# EAGLE design tvbgone-2layer (EAGLE 6.5.0)
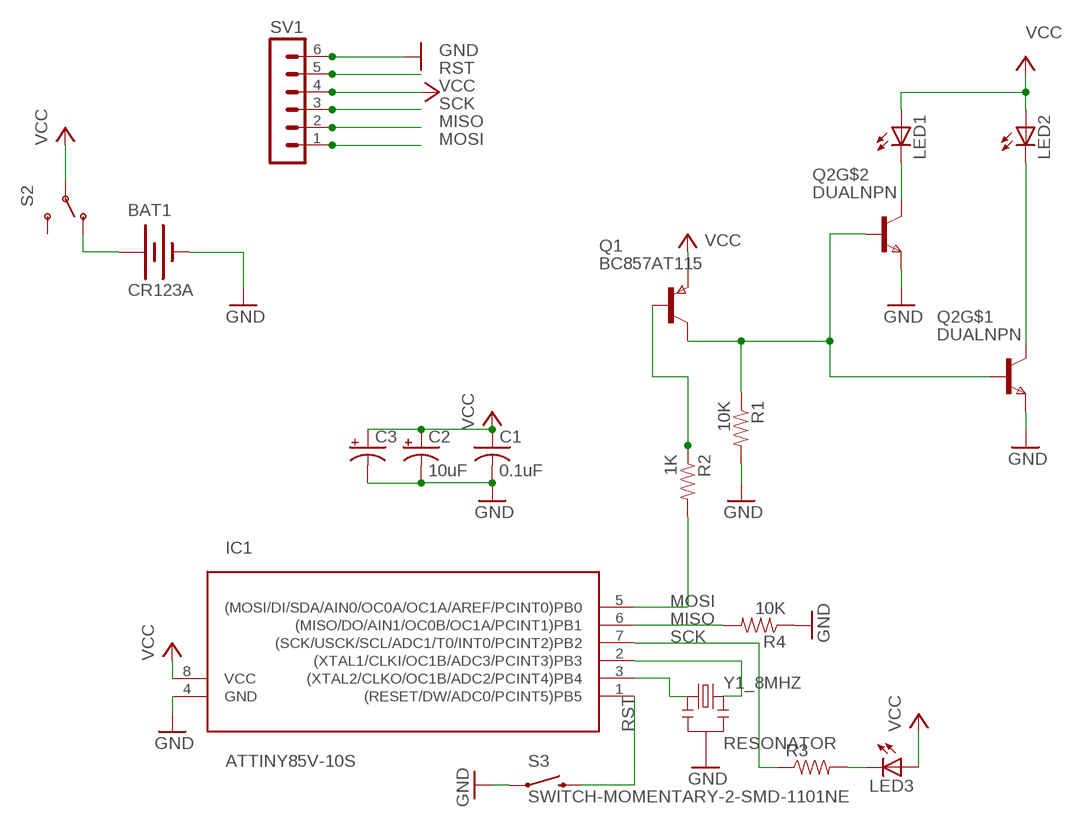
[diagram p0: schematic, sheet 1]

## Parts
BAT1  CR123A  TVBGONE-ADJ_BATTERYCR123A  [TVBGONE-ADJ_BATTERY_CR123A]
C1  0.1uF  C-USC0603K  [C0603K]
C2  10uF  CAP_POL1206  [EIA3216]
C3  SPARKFUN_CAP_POL3528  [SPARKFUN_EIA3528]
IC1  ATTINY85V-10S  [SOIC8]
LED1  TVBGONE3_LEDSIDEIR  [TVBGONE3_SIDE_IR_NSL]
LED2  TVBGONE3_LEDSIDEIR  [TVBGONE3_SIDE_IR_NSL]
LED3  LEDCHIPLED_0603  [CHIPLED_0603]
Q1  BC857AT115  PNPSOT323SOT416  [SOT416]
Q2  DUALNPN  [SSOT6]
R1  10K  RESISTOR  [0805]
R2  1K  RESISTOR  [0805]
R3  1K  RESISTOR  [0805]
R4  10K  RESISTOR  [0805]
S2  SWITCH-SPDT-SMD-A  [SWITCH-SPST-SMD-A]
S3  SWITCH-MOMENTARY-2-SMD-1101NE  [TACTILE-SWITCH-1101NE]
SV1  CON-LSTB_MA06-1  [CON-LSTB_MA06-1]
Y1_8MHZ  RESONATOR  SPARKFUN_RESONATORSMD  [SPARKFUN_RESONATOR-SMD]

## Nets
GND: BAT1.- C1.2 C2.C(-) C3.C(-) IC1.4(GND) Q2.2(E) Q2.5(E) R1.2 R4.1 S3.P$1 SV1.6 Y1_8MHZ.2
MISO: IC1.6((MISO/DO/AIN1/OC0B/OC1A/PCINT1)PB1) R4.2 SV1.2
MOSI: IC1.5((MOSI/DI/SDA/AIN0/OC0A/OC1A/AREF/PCINT0)PB0) R2.2 SV1.1
N$1: IC1.3((XTAL2/CLKO/OC1B/ADC2/PCINT4)PB4) Y1_8MHZ.1
N$2: IC1.2((XTAL1/CLKI/OC1B/ADC3/PCINT3)PB3) Y1_8MHZ.3
N$3: LED3.C R3.2
N$4: LED1.C Q2.4(C)
N$5: LED2.C Q2.6(C)
N$6: Q1.2(B) R2.1
N$8: BAT1.+ S2.1(O)
N$9: Q1.1(C) Q2.1(B) Q2.3(B) R1.1
RST: IC1.1((RESET/DW/ADC0/PCINT5)PB5) S3.P$2 SV1.5
SCK: IC1.7((SCK/USCK/SCL/ADC1/T0/INT0/PCINT2)PB2) R3.1 SV1.3
VCC: C1.1 C2.A(+) C3.A(+) IC1.8(VCC) LED1.A LED2.A LED3.A Q1.3(E) S2.2(P) SV1.4
Unconnected: S2.3(S)

## Library data of the parts
BAT1 = tvbgone-2layer:TVBGONE-ADJ_BATTERY: Battery Holders Various common sizes : AA, AAA, 20mm coin cell and 12mm coin cell.
C1 = rcl-ez:C-US: CAPACITOR, American symbol
C2 = SparkFun:CAP_POL: Capacitor Polarized These are standard SMD and PTH capacitors. Normally 10uF, 47uF, and 100uF in electrolytic and tantalum varieties. Always verify the external diameter of the through hole cap, it varies with capacity, voltage, and manufacturer. The EIA devices should be standard.
C3 = tvbgone-2layer:SPARKFUN_CAP_POL: Capacitor Polarized These are standard SMD and PTH capacitors. Normally 10uF, 47uF, and 100uF in electrolytic and tantalum varieties. Always verify the external diameter of the through hole cap, it varies with capacity, voltage, and manufacturer. The EIA devices should be standard.
IC1 = avr:ATTINY85: MICROCONTROLLER 8 Kbytes FLASH 512 bytes EEPROM 512 bytes RAM 4-channel 10 bit ADC USI
LED1 LED2 = tvbgone-2layer:TVBGONE3_LED: LED OSRAM: - CHIPLED LG R971, LG N971, LY N971, LG Q971, LY Q971, LO R971, LY R971 LH N974, LH R974 LS Q976, LO Q976, LY Q976 LO Q996 - Hyper CHIPLED LW Q18S LB Q993, LB Q99A, LB R99A - SideLED LS A670, LO A670, LY A670, LG A670, LP A670 LB A673, LV A673, LT A673, LW A673 LH A674 LY A675 LS A676, LA A676, LO A676, LY A676, LW A676 LS A679, LY A679, LG A679 - Hyper Micro SIDELED® LS Y876, LA Y876, LO Y876, LY Y876 LT Y87S - SmartLED LW L88C, LW L88S LB L89C, LB L89S, LG L890 LS L89K, LO L89K, LY L89K LS L896, LA L896, LO L896, LY L896 - TOPLED LS T670, LO T670, LY T670, LG T670, LP T670 LSG T670, LSP T670, LSY T670, LOP T670, LYG T670 LG T671, LOG T671, LSG T671 LB T673, LV T673, LT T673, LW T673 LH T674 LS T676, LA T676, LO T676, LY T676, LB T676, LH T676, LSB T676, LW T676 LB T67C, LV T67C, LT T67C, LS T67K, LO T67K, LY T67K, LW E67C LS E67B, LA E67B, LO E67B, LY E67B, LB E67C, LV E67C, LT E67C LW T67C LS T679, LY T679, LG T679 LS T770, LO T770, LY T770, LG T770, LP T770 LB T773, LV T773, LT T773, LW T773 LH T774 LS E675, LA E675, LY E675, LS T675 LS T776, LA T776, LO T776, LY T776, LB T776 LHGB T686 LT T68C, LB T68C - Hyper Mini TOPLED® LB M676 - Mini TOPLED Santana® LG M470 LS M47K, LO M47K, LY M47K Source: http://www.osram.convergy.de LUXEON: - LUMILED® LXK2-PW12-R00, LXK2-PW12-S00, LXK2-PW14-U00, LXK2-PW14-V00 LXK2-PM12-R00, LXK2-PM12-S00, LXK2-PM14-U00 LXK2-PE12-Q00, LXK2-PE12-R00, LXK2-PE12-S00, LXK2-PE14-T00, LXK2-PE14-U00 LXK2-PB12-K00, LXK2-PB12-L00, LXK2-PB12-M00, LXK2-PB14-N00, LXK2-PB14-P00, LXK2-PB14-Q00 LXK2-PR12-L00, LXK2-PR12-M00, LXK2-PR14-Q00, LXK2-PR14-R00 LXK2-PD12-Q00, LXK2-PD12-R00, LXK2-PD12-S00 LXK2-PH12-R00, LXK2-PH12-S00 LXK2-PL12-P00, LXK2-PL12-Q00, LXK2-PL12-R00 Source: www.luxeon.com KINGBRIGHT: KA-3528ASYC Source: www.kingbright.com
LED3 = minimidi:LED: LED OSRAM: - CHIPLED LG R971, LG N971, LY N971, LG Q971, LY Q971, LO R971, LY R971 LH N974, LH R974 LS Q976, LO Q976, LY Q976 LO Q996 - Hyper CHIPLED LW Q18S LB Q993, LB Q99A, LB R99A - SideLED LS A670, LO A670, LY A670, LG A670, LP A670 LB A673, LV A673, LT A673, LW A673 LH A674 LY A675 LS A676, LA A676, LO A676, LY A676, LW A676 LS A679, LY A679, LG A679 - Hyper Micro SIDELED® LS Y876, LA Y876, LO Y876, LY Y876 LT Y87S - SmartLED LW L88C, LW L88S LB L89C, LB L89S, LG L890 LS L89K, LO L89K, LY L89K LS L896, LA L896, LO L896, LY L896 - TOPLED LS T670, LO T670, LY T670, LG T670, LP T670 LSG T670, LSP T670, LSY T670, LOP T670, LYG T670 LG T671, LOG T671, LSG T671 LB T673, LV T673, LT T673, LW T673 LH T674 LS T676, LA T676, LO T676, LY T676, LB T676, LH T676, LSB T676, LW T676 LB T67C, LV T67C, LT T67C, LS T67K, LO T67K, LY T67K, LW E67C LS E67B, LA E67B, LO E67B, LY E67B, LB E67C, LV E67C, LT E67C LW T67C LS T679, LY T679, LG T679 LS T770, LO T770, LY T770, LG T770, LP T770 LB T773, LV T773, LT T773, LW T773 LH T774 LS E675, LA E675, LY E675, LS T675 LS T776, LA T776, LO T776, LY T776, LB T776 LHGB T686 LT T68C, LB T68C - Hyper Mini TOPLED® LB M676 - Mini TOPLED Santana® LG M470 LS M47K, LO M47K, LY M47K Source: http://www.osram.convergy.de/
Q1 = zetex:PNPSOT323: PNP TRANSISTOR
Q2 = 6x6:DUALNPN
R1-R4 = SparkFun:RESISTOR: Resistor Basic schematic elements and footprints for 0603, 1206, and PTH 1/10th watt (small) resistors.
S2 = SparkFun-Electromechanical:SWITCH-SPDT: SPDT Switch Simple slide switch, Spark Fun Electronics SKU : COM-00102 DPDT SMT slide switch, AYZ0202, SWCH-08179
S3 = SparkFun-Electromechanical:SWITCH-MOMENTARY-2: Various NO switches- pushbuttons, reed, etc
SV1 = NSL:CON-LSTB_MA06-1: PIN HEADER
Y1_8MHZ = tvbgone-2layer:SPARKFUN_RESONATOR: Resonator Small SMD resonator. This is the itty bitty 10/20MHz resonators with built in caps. CSTCE10M0G55 and CSTCE20M0V53. Footprint has been reviewed closely but hasn't been tested yet.

## Board
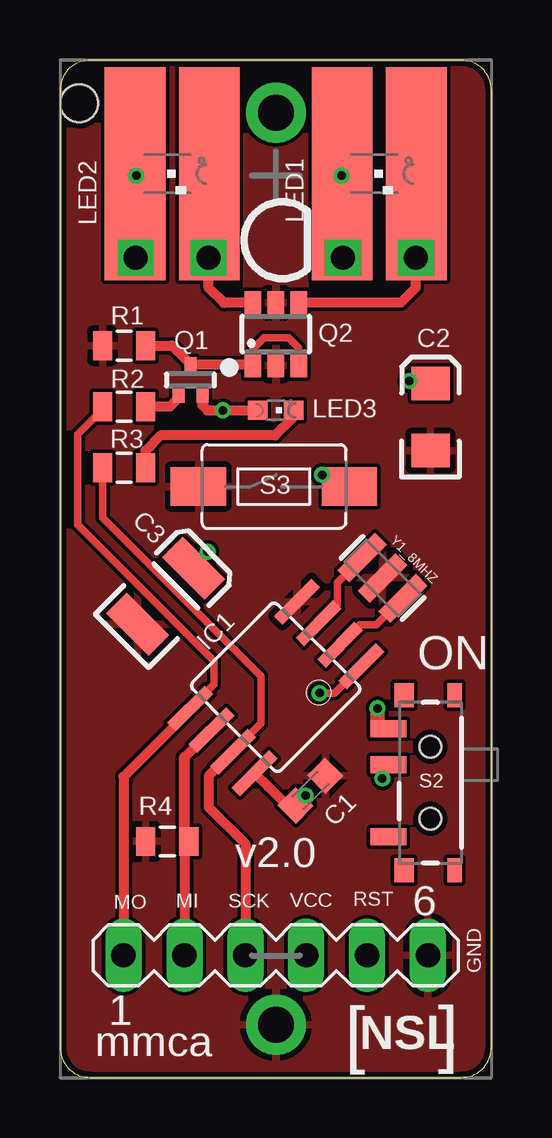
[diagram p1: board, top side]
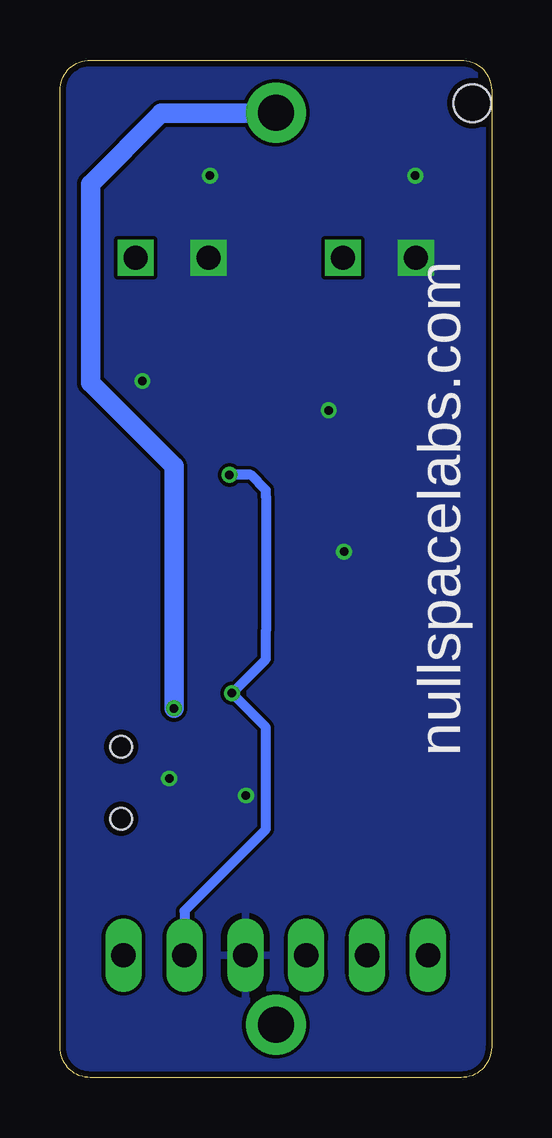
[diagram p2: board, bottom side, seen from below]

Size 18 x 42.4 mm. Coordinates in mm from the lower left corner, seen from the top.
Outline: 16.73,0 arc90 18,1.27 18,41.13 arc90 16.73,42.4 1.27,42.4 arc90 0,41.13 0,1.27 arc90 1.27,0 16.73,0
Copper layers (1*16): Top 0.035mm / dielectric 1.5mm / Bottom 0.035mm
Design rules "ITEADstudio_DRC": minimum track width 6mil, minimum drill 12mil, track to track 6mil, track to pad 6mil, pad to pad 6mil, via to via 6mil, smd to smd 0mil, copper to edge 10mil, drill to drill 10mil, minimum pad ring 10mil, minimum via ring 6mil, stop-mask expansion 2mil, vias tented up to drill 100mil, thermal gap 10mil

### Footprints (pad centres in the part's own frame; a part is rotated, then mirrored left to right if it is on the bottom)
TVBGONE-ADJ_BATTERY_CR123A = drill 1.5 pad 2.5: + 19,0; - -19,0 | hole 1.575: 19.4,8.2
C0603K = smd 1.05 x 1.08: 1 -0.875,0; 2 0.875,0
EIA3216 = smd 1.4 x 1.6: A 1.4,0; C -1.4,0
SPARKFUN_EIA3528 = smd 1.2 x 2.5: A 1.65,0; C -1.65,0
SOIC8 = smd 0.5 x 2.2: 1 -1.905,-3.154; 2 -0.645,-3.154; 3 0.625,-3.154; 4 1.895,-3.154; 5 1.905,3.154; 6 0.635,3.154; 7 -0.635,3.154; 8 -1.905,3.154
TVBGONE3_SIDE_IR_NSL = smd 2.54 x 8.89: A -1.547,0; C 1.547,0
CHIPLED_0603 = smd 0.8 x 0.8: A 0,-0.75; C 0,0.75
SOT416 = smd 0.6 x 0.5: 1 -0.65,0; 2 0.65,-0.5; 3 0.65,0.5
SSOT6 = smd 0.69 x 0.99: 1 -0.95,-1.3; 2 0,-1.3; 3 0.95,-1.3; 4 0.95,1.3; 5 0,1.3; 6 -0.95,1.3
0805 = smd 0.8 x 1.2: 1 -0.9,0; 2 0.9,0
SWITCH-SPST-SMD-A = smd 0.7 x 1.5: 1 -2.25,-1.75; 2 -0.75,-1.75; 3 2.25,-1.75 | smd 1 x 0.6: GND1 -3.65,1; GND3 3.65,1 | smd 1 x 0.8: GND2 -3.65,-1.1; GND4 3.65,-1.1 | hole 0.9: -1.5,0; 1.5,0
TACTILE-SWITCH-1101NE = smd 2.3 x 1.6: P$1 -3.15,0; P$2 3.15,0
CON-LSTB_MA06-1 = drill 1.016 long: 1 -6.35,0; 2 -3.81,0; 3 -1.27,0; 4 1.27,0; 5 3.81,0; 6 6.35,0
SPARKFUN_RESONATOR-SMD = smd 0.7 x 2.2: 1 -1.2,0; 2 0,0; 3 1.2,0

### Placement (x,y rotation side)
BAT1  9,21.2 90 top
C1  10.45,11.96 45 top
C2  15.45,27.52 90 top
C3  4.4,20.05 45 top
IC1  9,16.26 135 top
LED1  13.32,37.66 0 top
LED2  4.68,37.66 0 top
LED3  9,27.8 270 top
Q1  5.44,29.07 270 top
Q2  9,30.98 0 top
R1  2.68,30.5 180 top
R2  2.68,27.96 180 top
R3  2.68,25.42 0 top
R4  4.47,9.84 0 top
S2  15.45,12.28 270 top
S3  8.92,24.63 0 top
SV1  9,5.1 0 top
Y1_8MHZ  13.46,20.82 315 top

### Tracks (layer width: path | path; a pad name or v marks a point on that pad's centre or on a via)
GND
  pour Top: -0.04,42.28 18.22,42.28 18.22,0.12 -0.04,-0.09
MISO
  Top 0.305: 5.17,10.3 5.17,9.84 R4.2 | SV1.2 arc90 5.17,5.12
  Top 0.406: IC1.6 5.19,13.35 | 5.19,13.35 SV1.2 | 5.19,13.35 5.17,13.33 5.17,10.3
MOSI
  Top 0.305: IC1.5 5.46,15.35 | R2.2 1.78,27.84 0.74,26.81 0.74,23.03 0.97,22.8 6.44,17.34 6.44,16.39 IC1.5 | 5.46,15.38 IC1.5
  Top 0.406: 5.46,15.35 2.65,12.54 SV1.1
N$1
  Top 0.305: 10.82,18.99 IC1.3 | IC1.3 | Y1_8MHZ.1 11.56,20.62 11.56,19.73 10.79,18.95 IC1.3
N$2
  Top 0.305: Y1_8MHZ.3 13.2,18.86 12.5,18.86 IC1.2
N$3
  Top 0.305: R3.2 3.58,25.63
  Top 0.406: LED3.C 9.75,27.54 8.97,26.76 4.2,26.76 3.56,26.13 3.56,25.43 R3.2
N$4  (via drill 1)
  Top 0.305: Q2.4 9.97,32.3 | 14.87,33.47 14.87,34.56 LED1.C
  Top 0.406: 9.97,32.3 14.23,32.3 14.84,32.91 | 14.84,32.91 v14.84,34.15 | 14.84,32.91 14.84,34.54 14.87,34.56
N$5  (via drill 1)
  Top 0.305: LED2.C 6.28,36.44 6.33,36.44
  Top 0.406: Q2.6 6.84,32.28 6.21,32.91 v6.21,34.15 6.28,34.23 6.28,36.44
N$6
  Top 0.406: Q1.2 4.94,28.32 4.58,27.96 R2.1
N$8  (via drill 0.36)
  Top 0.61: v13.24,15.38 13.24,14.54 S2.1
  Bottom 0.813: v13.24,15.38 13.24,25.47 16.72,28.95 16.72,37.23 13.78,40.17 9.03,40.17 BAT1.+
N$9
  Top 0.305: 8.05,29.72 Q2.1 8.04,29.69 8.04,30.34 8.52,30.83 8.97,30.83 9.53,30.83 9.94,30.42 Q2.3
  Top 0.406: R1.1 4.67,30.5 Q1.1 8.01,29.72 Q2.1
RST  (via drill 0.36)
  Top 0.305: 10.96,16.14 v10.83,16.02 11.45,16.02 IC1.1
  Top 0.406: v10.93,25.11 11.41,24.63 S3.P$2
  Bottom 0.406: SV1.5 12.81,6.95 9.41,10.35 9.41,14.6 v10.83,16.02 9.41,17.44 9.41,18.61 9.41,24.22 9.41,24.48 10.04,25.11 v10.93,25.11
SCK
  Top 0.305: 7.25,13.58 IC1.7 8.39,14.75 8.39,16.73 1.79,23.33 1.79,25.41 R3.1
  Top 0.406: IC1.7 6.21,12.57 6.21,11.27 7.73,9.74 SV1.3
VCC  (via drill 0.36, 1)
  Top 0.305: S2.2 13.45,12.83 v13.45,12.46 | C3.A 6.15,21.81 v6.15,21.91
  Top 0.406: LED3.A 7.48,27.8 v6.79,27.8 6.15,27.8 5.94,28.02 Q1.3 | IC1.8 8.67,12.13 9.46,11.34 C1.1 v10.24,11.75 v10.25,11.75
  Top 0.61: LED2.A 3.19,36.39 v3.18,37.58 | LED1.A 12.36,36.39 v11.74,37.58 | v14.56,29.02 15.35,29.02 C2.A
  other vias: 3.16,34.15 11.79,34.15
  pour Bottom: -0.73,43.12 19.08,43.12 18.98,-0.44 -0.4,-0.77

### Text on the board
tPlace: ON | v2.0 | MO | MI | SCK | VCC | RST | GND | mmca | [ | NSL | ]
bPlace: nullspacelabs.com
_tsilk: + | - | + | -